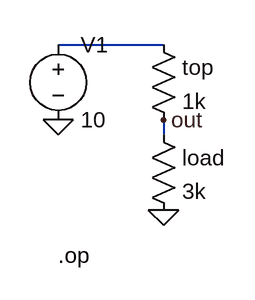
[diagram p0: schematic divider.asc]
divider.asc, the LTspice schematic file:
Version 4
SHEET 1 1600 1000
WIRE 0 16 112 16
WIRE 112 96 112 112
FLAG 0 96 0
FLAG 112 192 0
FLAG 112 96 out
SYMBOL voltage 0 0 R0
SYMATTR InstName V1
SYMATTR Value 10
SYMBOL res 96 0 R0
SYMATTR InstName top
SYMATTR Value 1k
SYMBOL res 96 96 R0
SYMATTR InstName load
SYMATTR Value 3k
TEXT 0 240 Left 2 !.op

The netlist it stands for:
* divider.asc
V1 N001 0 10
R§top N001 out 1k
R§load out 0 3k
.op
.backanno
.end